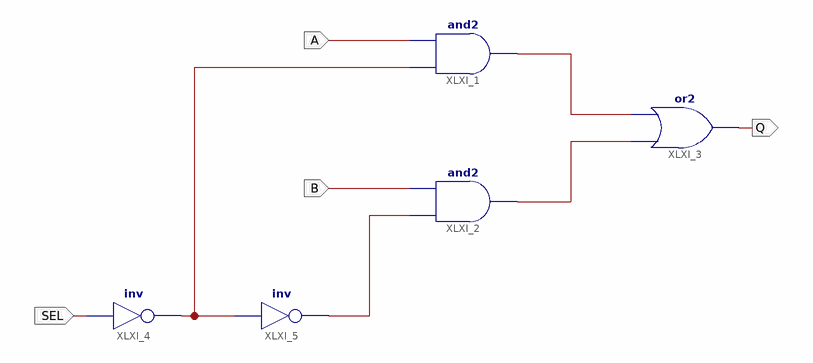
[diagram p0: schematic sheet 1]
// Xilinx ISE schematic data_selector.sch (spartan6) as structural Verilog: 5 symbols, 4 ports
module data_selector (
  input  A,
  input  B,
  input  SEL,
  output Q
);

  wire XLXN_1, XLXN_2, XLXN_5, XLXN_6;

  and XLXI_1 (XLXN_5, XLXN_1, A);
  and XLXI_2 (XLXN_6, XLXN_2, B);
  or XLXI_3 (Q, XLXN_6, XLXN_5);
  not XLXI_4 (XLXN_1, SEL);
  not XLXI_5 (XLXN_2, XLXN_1);
endmodule
